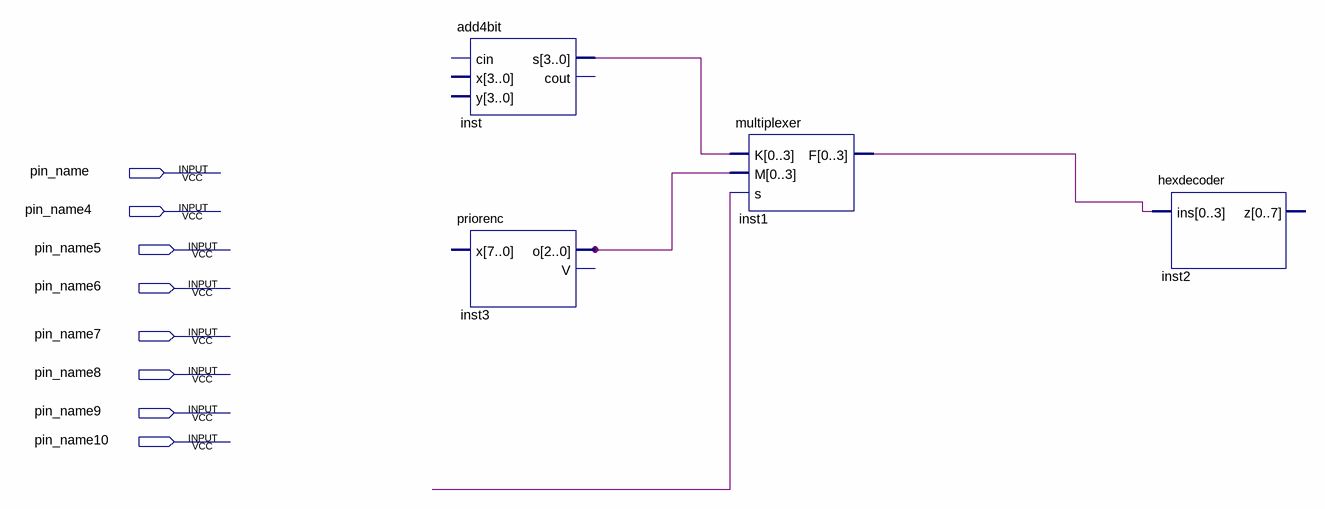
[diagram p0: schematic sheet]
// Quartus schematic move.bdf as structural Verilog: 4 symbols, 8 pins
module move (
  input  pin_name,
  input  pin_name4,
  input  pin_name5,
  input  pin_name6,
  input  pin_name7,
  input  pin_name8,
  input  pin_name9,
  input  pin_name10
);

  wire inst3_o, undriven;
  wire [3:0] inst1_f, inst_s;

  add4bit inst (.s(inst_s));  // open: cin, x, y, cout
  priorenc inst3 (.o(inst3_o));  // open: x, V
  multiplexer inst1 (.K(inst_s), .M({4{inst3_o}}), .s(undriven), .F(inst1_f));
  hexdecoder inst2 (.ins(inst1_f));  // open: z
endmodule
